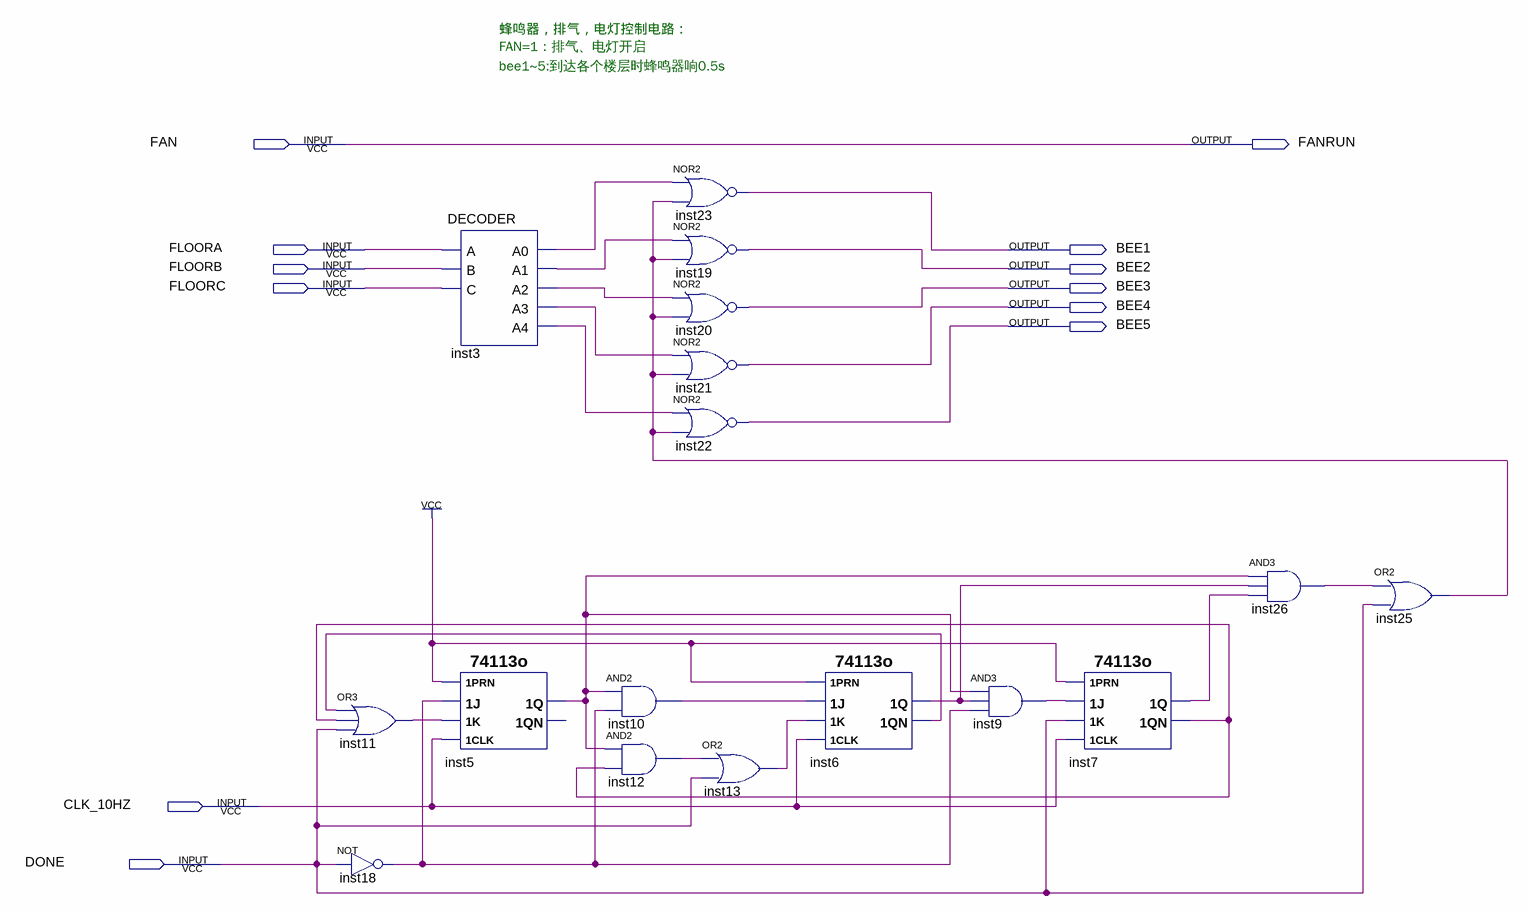
[diagram p0: schematic sheet]
// Quartus schematic otherdevice.bdf as structural Verilog: 17 symbols, 12 pins
module otherdevice (
  input  FAN,
  input  FLOORA,
  input  FLOORB,
  input  FLOORC,
  input  CLK_10HZ,
  input  DONE,
  output FANRUN,
  output BEE1,
  output BEE2,
  output BEE3,
  output BEE4,
  output BEE5
);

  wire inst3_a0, inst3_a1, inst3_a2, inst3_a3, inst3_a4, inst5_1q, inst6_1q, inst6_1qn, inst7_1q, inst7_1qn,
       inst9_out, inst10_out, inst11_out, inst12_out, inst13_out, inst18_out, inst25_out, inst26_out;

  or inst11 (inst11_out, inst6_1qn, inst7_1qn, DONE);
  not inst18 (inst18_out, DONE);
  DECODER inst3 (
    .A(FLOORA), .B(FLOORB), .C(FLOORC), .A0(inst3_a0), .A1(inst3_a1), .A2(inst3_a2), .A3(inst3_a3),
    .A4(inst3_a4));
  \74113o  inst5 (
    .\1K (inst11_out), .\1J (inst18_out), .\1CLK (CLK_10HZ), .\1PRN (1'b1), .\1Q (inst5_1q));  // open: 1QN
  nor inst23 (BEE1, inst3_a0, inst25_out);
  nor inst19 (BEE2, inst3_a1, inst25_out);
  nor inst20 (BEE3, inst3_a2, inst25_out);
  nor inst21 (BEE4, inst3_a3, inst25_out);
  nor inst22 (BEE5, inst3_a4, inst25_out);
  and inst10 (inst10_out, inst5_1q, inst18_out);
  and inst12 (inst12_out, inst5_1q, inst7_1qn);
  or inst13 (inst13_out, inst12_out, DONE);
  \74113o  inst6 (
    .\1K (inst13_out), .\1J (inst10_out), .\1CLK (CLK_10HZ), .\1PRN (1'b1), .\1QN (inst6_1qn), .\1Q (inst6_1q));
  and inst9 (inst9_out, inst5_1q, inst6_1q, inst18_out);
  \74113o  inst7 (.\1K (DONE), .\1J (inst9_out), .\1CLK (CLK_10HZ), .\1PRN (1'b1), .\1QN (inst7_1qn), .\1Q (inst7_1q));
  and inst26 (inst26_out, inst5_1q, inst6_1q, inst7_1q);
  or inst25 (inst25_out, inst26_out, DONE);

  assign FANRUN = FAN;

  // Notes on the sheet:
  //   蜂鸣器，排气，电灯控制电路：
  //   FAN=1：排气、电灯开启
  //   bee1~5:到达各个楼层时蜂鸣器响0.5s
endmodule
